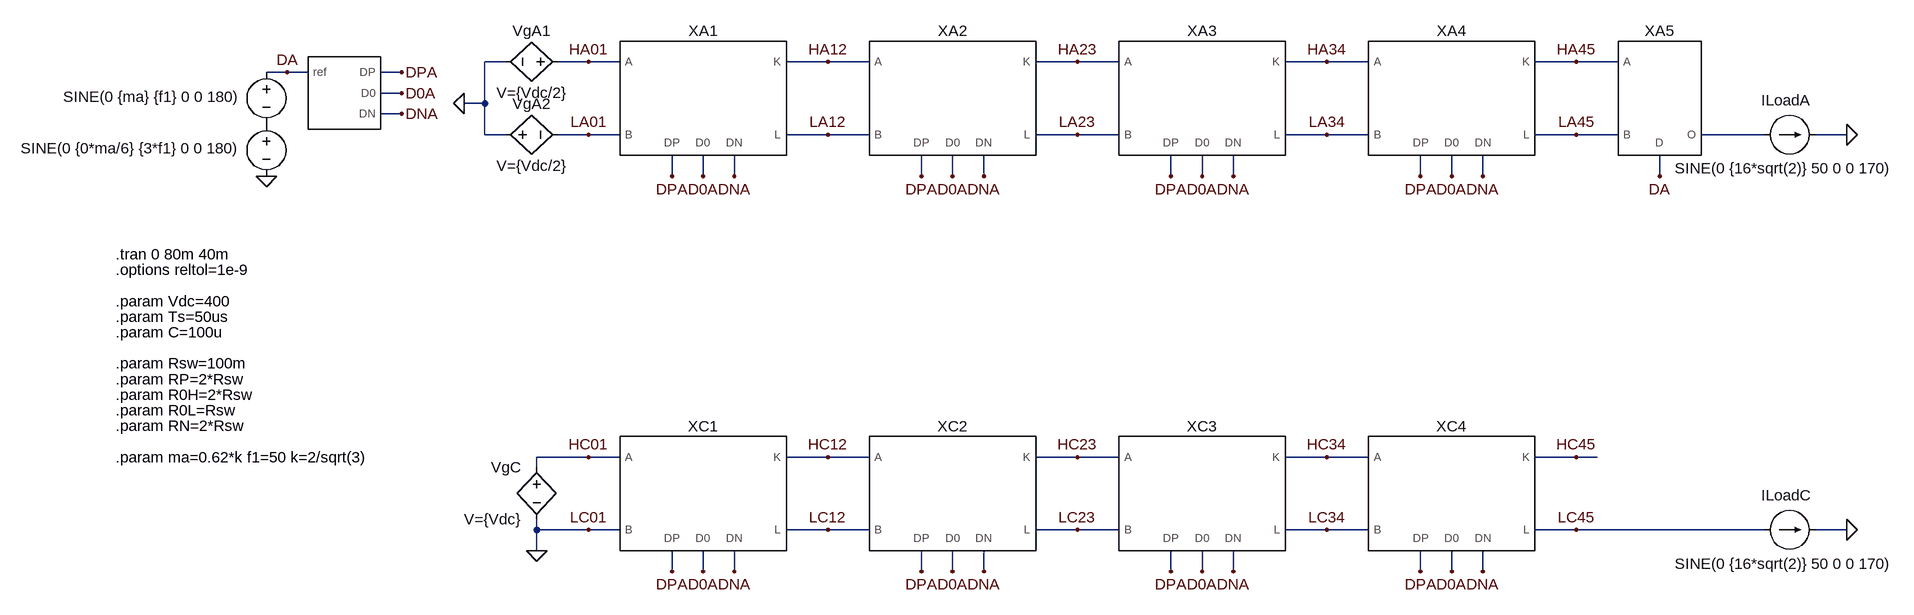
[diagram p0: schematic converter_scaling_ideal_2.asc]
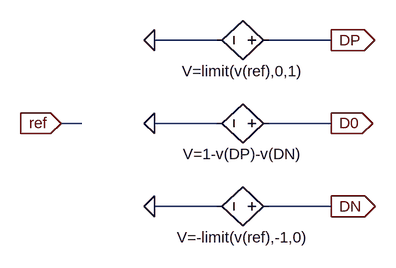
[diagram p1: sub-circuit pn_average_modulator.asc]
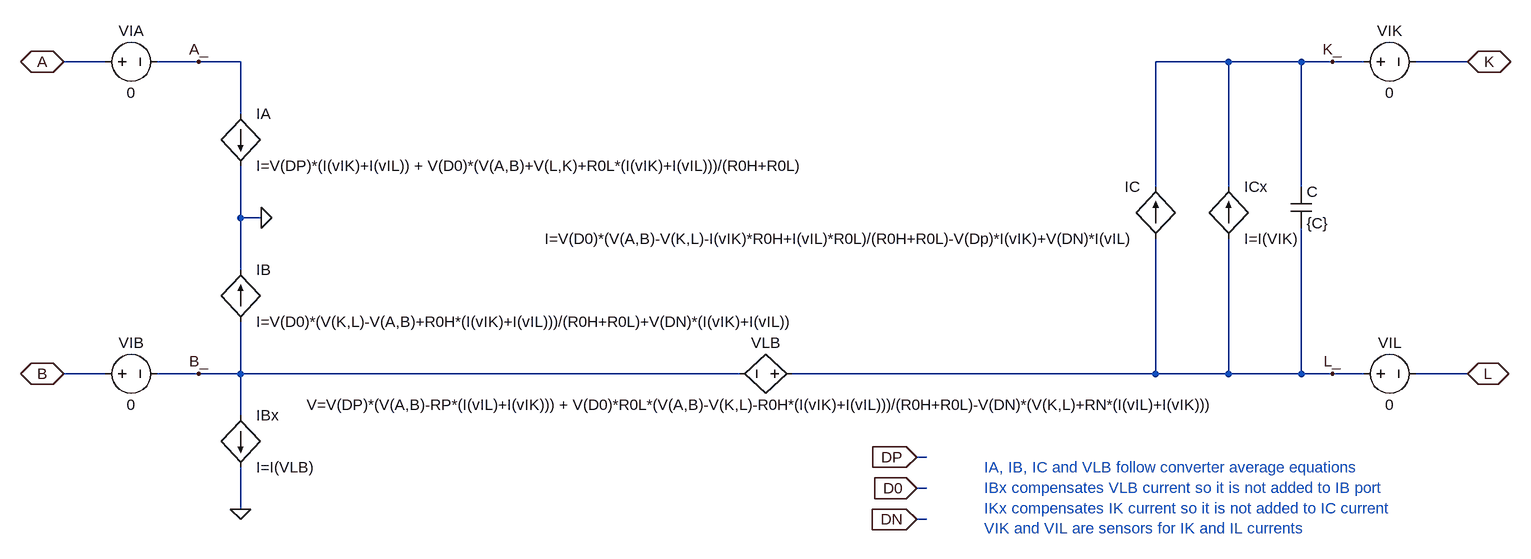
[diagram p2: sub-circuit pn_average_model.asc]
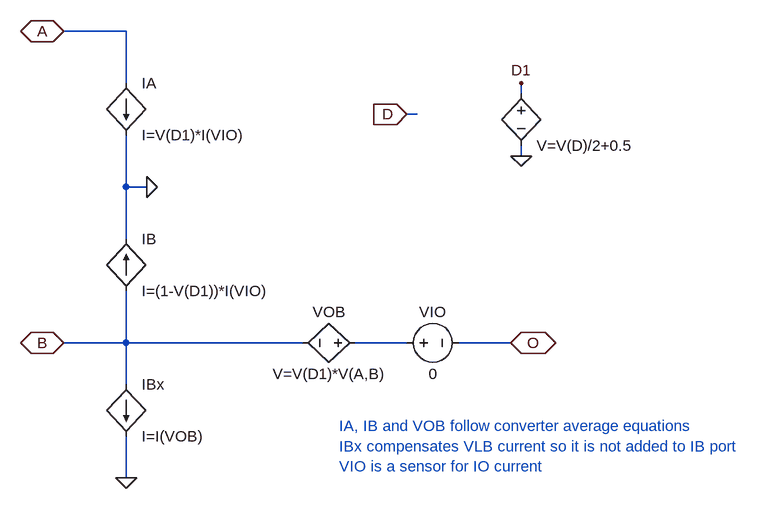
[diagram p3: sub-circuit 2l_average_model.asc]
converter_scaling_ideal_2.asc, the LTspice schematic file:
Version 4
SHEET 1 4616 1844
WIRE 2080 -1392 2048 -1392
WIRE 2208 -1392 2160 -1392
WIRE 2256 -1392 2208 -1392
WIRE 2576 -1392 2512 -1392
WIRE 2640 -1392 2576 -1392
WIRE 2960 -1392 2896 -1392
WIRE 3024 -1392 2960 -1392
WIRE 3344 -1392 3280 -1392
WIRE 3408 -1392 3344 -1392
WIRE 3728 -1392 3664 -1392
WIRE 3792 -1392 3728 -1392
WIRE 1744 -1376 1712 -1376
WIRE 1776 -1376 1744 -1376
WIRE 1920 -1376 1888 -1376
WIRE 1920 -1344 1888 -1344
WIRE 2048 -1328 2048 -1392
WIRE 2048 -1328 2016 -1328
WIRE 1920 -1312 1888 -1312
WIRE 2048 -1280 2048 -1328
WIRE 2080 -1280 2048 -1280
WIRE 2208 -1280 2160 -1280
WIRE 2256 -1280 2208 -1280
WIRE 2576 -1280 2512 -1280
WIRE 2640 -1280 2576 -1280
WIRE 2960 -1280 2896 -1280
WIRE 3024 -1280 2960 -1280
WIRE 3344 -1280 3280 -1280
WIRE 3408 -1280 3344 -1280
WIRE 3728 -1280 3664 -1280
WIRE 3792 -1280 3728 -1280
WIRE 4016 -1280 3920 -1280
WIRE 4144 -1280 4096 -1280
WIRE 2336 -1216 2336 -1248
WIRE 2384 -1216 2384 -1248
WIRE 2432 -1216 2432 -1248
WIRE 2720 -1216 2720 -1248
WIRE 2768 -1216 2768 -1248
WIRE 2816 -1216 2816 -1248
WIRE 3104 -1216 3104 -1248
WIRE 3152 -1216 3152 -1248
WIRE 3200 -1216 3200 -1248
WIRE 3488 -1216 3488 -1248
WIRE 3536 -1216 3536 -1248
WIRE 3584 -1216 3584 -1248
WIRE 3856 -1216 3856 -1248
WIRE 2208 -784 2128 -784
WIRE 2256 -784 2208 -784
WIRE 2576 -784 2512 -784
WIRE 2640 -784 2576 -784
WIRE 2960 -784 2896 -784
WIRE 3024 -784 2960 -784
WIRE 3344 -784 3280 -784
WIRE 3408 -784 3344 -784
WIRE 3728 -784 3664 -784
WIRE 3760 -784 3728 -784
WIRE 2128 -768 2128 -784
WIRE 2128 -672 2128 -688
WIRE 2208 -672 2128 -672
WIRE 2256 -672 2208 -672
WIRE 2576 -672 2512 -672
WIRE 2640 -672 2576 -672
WIRE 2960 -672 2896 -672
WIRE 3024 -672 2960 -672
WIRE 3344 -672 3280 -672
WIRE 3408 -672 3344 -672
WIRE 3728 -672 3664 -672
WIRE 4016 -672 3728 -672
WIRE 4144 -672 4096 -672
WIRE 2128 -640 2128 -672
WIRE 2336 -608 2336 -640
WIRE 2384 -608 2384 -640
WIRE 2432 -608 2432 -640
WIRE 2720 -608 2720 -640
WIRE 2768 -608 2768 -640
WIRE 2816 -608 2816 -640
WIRE 3104 -608 3104 -640
WIRE 3152 -608 3152 -640
WIRE 3200 -608 3200 -640
WIRE 3488 -608 3488 -640
WIRE 3536 -608 3536 -640
WIRE 3584 -608 3584 -640
FLAG 1920 -1376 DPA
FLAG 1920 -1344 D0A
FLAG 1920 -1312 DNA
FLAG 1712 -1216 0
FLAG 1744 -1376 DA
FLAG 2336 -1216 DPA
FLAG 2384 -1216 D0A
FLAG 2432 -1216 DNA
FLAG 2016 -1328 0
FLAG 4144 -1280 0
FLAG 2720 -1216 DPA
FLAG 2768 -1216 D0A
FLAG 2816 -1216 DNA
FLAG 3104 -1216 DPA
FLAG 3152 -1216 D0A
FLAG 3200 -1216 DNA
FLAG 3488 -1216 DPA
FLAG 3536 -1216 D0A
FLAG 3584 -1216 DNA
FLAG 3856 -1216 DA
FLAG 2336 -608 DPA
FLAG 2384 -608 D0A
FLAG 2432 -608 DNA
FLAG 2128 -640 0
FLAG 4144 -672 0
FLAG 2720 -608 DPA
FLAG 2768 -608 D0A
FLAG 2816 -608 DNA
FLAG 3104 -608 DPA
FLAG 3152 -608 D0A
FLAG 3200 -608 DNA
FLAG 3488 -608 DPA
FLAG 3536 -608 D0A
FLAG 3584 -608 DNA
FLAG 2208 -1392 HA01
FLAG 2576 -1392 HA12
FLAG 2960 -1392 HA23
FLAG 3344 -1392 HA34
FLAG 3728 -1392 HA45
FLAG 2208 -1280 LA01
FLAG 2576 -1280 LA12
FLAG 2960 -1280 LA23
FLAG 3344 -1280 LA34
FLAG 3728 -1280 LA45
FLAG 2208 -784 HC01
FLAG 2576 -784 HC12
FLAG 2960 -784 HC23
FLAG 3344 -784 HC34
FLAG 3728 -784 HC45
FLAG 2208 -672 LC01
FLAG 2576 -672 LC12
FLAG 2960 -672 LC23
FLAG 3344 -672 LC34
FLAG 3728 -672 LC45
SYMBOL voltage 1712 -1392 M0
WINDOW 0 24 16 Invisible 2
WINDOW 3 39 54 Left 2
SYMATTR InstName V1
SYMATTR Value SINE(0 {ma} {f1} 0 0 180)
SYMBOL voltage 1712 -1312 M0
WINDOW 0 24 16 Invisible 2
WINDOW 3 39 53 Left 2
SYMATTR InstName V7
SYMATTR Value SINE(0 {0*ma/6} {3*f1} 0 0 180)
SYMBOL PN_average_modulator 1824 -1344 R0
WINDOW 0 8 -56 Invisible 2
SYMATTR InstName X2
SYMBOL bv 2176 -1392 M270
WINDOW 0 32 56 VTop 2
WINDOW 3 -32 56 VBottom 2
SYMATTR InstName VgA1
SYMATTR Value V={Vdc/2}
SYMBOL PN_average_model 2384 -1344 R0
SYMATTR InstName XA1
SYMATTR SpiceLine C={C*4} RP={RP/4} R0H={R0H/4} R0L={R0L/4} RN={RN/4}
SYMBOL current 4016 -1280 M90
WINDOW 123 0 0 Left 2
WINDOW 39 0 0 Left 2
WINDOW 3 52 -137 VRight 2
WINDOW 0 -53 -4 VRight 2
SYMATTR Value SINE(0 {16*sqrt(2)} 50 0 0 170)
SYMATTR InstName ILoadA
SYMBOL PN_average_model 2768 -1344 R0
SYMATTR InstName XA2
SYMATTR SpiceLine C={C*3} RP={RP/3} R0H={R0H/3} R0L={R0L/3} RN={RN/3}
SYMBOL PN_average_model 3152 -1344 R0
SYMATTR InstName XA3
SYMATTR SpiceLine C={C*2} RP={RP/2} R0H={R0H/2} R0L={R0L/2} RN={RN/2}
SYMBOL PN_average_model 3536 -1344 R0
SYMATTR InstName XA4
SYMATTR SpiceLine C={C} RP={RP} R0H={R0H} R0L={R0L} RN={RN}
SYMBOL 2L_average_model 3856 -1360 R0
SYMATTR InstName XA5
SYMBOL bv 2128 -784 M0
SYMATTR InstName VgC
SYMATTR Value V={Vdc}
SYMBOL PN_average_model 2384 -736 R0
SYMATTR InstName XC1
SYMATTR SpiceLine C={C*4} RP={RP/4} R0H={R0H/4} R0L={R0L/4} RN={RN/4}
SYMBOL current 4016 -672 M90
WINDOW 123 0 0 Left 2
WINDOW 39 0 0 Left 2
WINDOW 3 52 -137 VRight 2
WINDOW 0 -53 -4 VRight 2
SYMATTR Value SINE(0 {16*sqrt(2)} 50 0 0 170)
SYMATTR InstName ILoadC
SYMBOL PN_average_model 2768 -736 R0
SYMATTR InstName XC2
SYMATTR SpiceLine C={C*3} RP={RP/3} R0H={R0H/3} R0L={R0L/3} RN={RN/3}
SYMBOL PN_average_model 3152 -736 R0
SYMATTR InstName XC3
SYMATTR SpiceLine C={C*2} RP={RP/2} R0H={R0H/2} R0L={R0L/2} RN={RN/2}
SYMBOL PN_average_model 3536 -736 R0
SYMATTR InstName XC4
SYMATTR SpiceLine C={C} RP={RP} R0H={R0H} R0L={R0L} RN={RN}
SYMBOL bv 2064 -1280 M90
WINDOW 0 -32 56 VBottom 2
WINDOW 3 32 56 VTop 2
SYMATTR InstName VgA2
SYMATTR Value V={Vdc/2}
TEXT 1480 -1000 Left 2 !.param Ts=50us
TEXT 1480 -1096 Left 2 !.tran 0 80m 40m
TEXT 1480 -1024 Left 2 !.param Vdc=400
TEXT 1480 -784 Left 2 !.param ma=0.62*k f1=50 k=2/sqrt(3)
TEXT 1480 -928 Left 2 !.param Rsw=100m
TEXT 1480 -904 Left 2 !.param RP=2*Rsw
TEXT 1480 -832 Left 2 !.param RN=2*Rsw
TEXT 1480 -880 Left 2 !.param R0H=2*Rsw
TEXT 1480 -856 Left 2 !.param R0L=Rsw
TEXT 1480 -976 Left 2 !.param C=100u
TEXT 1480 -1072 Left 2 !.options reltol=1e-9

pn_average_modulator.asc, the sub-circuit schematic file:
Version 4
SHEET 1 880 680
WIRE 304 160 208 160
WIRE 480 160 384 160
WIRE 96 288 64 288
WIRE 304 288 208 288
WIRE 480 288 384 288
WIRE 304 416 208 416
WIRE 480 416 384 416
FLAG 208 160 0
FLAG 208 288 0
FLAG 208 416 0
FLAG 480 160 DP
IOPIN 480 160 Out
FLAG 480 288 D0
IOPIN 480 288 Out
FLAG 480 416 DN
IOPIN 480 416 Out
FLAG 64 288 ref
IOPIN 64 288 In
SYMBOL bv 400 160 R90
WINDOW 0 -32 56 Invisible 2
WINDOW 3 32 56 VTop 2
SYMATTR InstName Bpos1
SYMATTR Value V=limit(v(ref),0,1)
SYMBOL bv 400 288 R90
WINDOW 0 -32 56 Invisible 2
WINDOW 3 32 56 VTop 2
SYMATTR InstName Bzero1
SYMATTR Value V=1-v(DP)-v(DN)
SYMBOL bv 400 416 R90
WINDOW 0 -32 56 Invisible 2
WINDOW 3 32 56 VTop 2
SYMATTR InstName Bneg1
SYMATTR Value V=-limit(v(ref),-1,0)

pn_average_model.asc, the sub-circuit schematic file:
Version 4
SHEET 1 2060 780
WIRE -720 16 -784 16
WIRE -576 16 -640 16
WIRE -512 16 -576 16
WIRE 1008 16 896 16
WIRE 1120 16 1008 16
WIRE 1168 16 1120 16
WIRE 1216 16 1168 16
WIRE 1376 16 1296 16
WIRE -512 96 -512 16
WIRE 896 208 896 16
WIRE 1008 208 1008 16
WIRE 1120 208 1120 16
WIRE -512 256 -512 176
WIRE -480 256 -512 256
WIRE -512 336 -512 256
WIRE -720 496 -784 496
WIRE -576 496 -640 496
WIRE -512 496 -512 416
WIRE -512 496 -576 496
WIRE 256 496 -512 496
WIRE 896 496 896 288
WIRE 896 496 336 496
WIRE 1008 496 1008 288
WIRE 1008 496 896 496
WIRE 1120 496 1120 272
WIRE 1120 496 1008 496
WIRE 1168 496 1120 496
WIRE 1216 496 1168 496
WIRE 1376 496 1296 496
WIRE -512 560 -512 496
WIRE 544 624 528 624
WIRE 544 672 528 672
WIRE -512 704 -512 640
WIRE 544 720 528 720
FLAG 1376 16 K
IOPIN 1376 16 BiDir
FLAG 1376 496 L
IOPIN 1376 496 BiDir
FLAG -784 16 A
IOPIN -784 16 BiDir
FLAG -784 496 B
IOPIN -784 496 BiDir
FLAG 528 624 DP
IOPIN 528 624 In
FLAG 528 672 D0
IOPIN 528 672 In
FLAG 528 720 DN
IOPIN 528 720 In
FLAG -480 256 0
FLAG -512 704 0
FLAG -576 16 A_
FLAG -576 496 B_
FLAG 1168 16 K_
FLAG 1168 496 L_
SYMBOL bv 352 496 R90
WINDOW 0 -32 56 VBottom 2
WINDOW 3 32 56 VTop 2
SYMATTR InstName VLB
SYMATTR Value V=V(DP)*(V(A,B)-RP*(I(vIL)+I(vIK))) + V(D0)*R0L*(V(A,B)-V(K,L)-R0H*(I(vIK)+I(vIL)))/(R0H+R0L)-V(DN)*(V(K,L)+RN*(I(vIL)+I(vIK)))
SYMBOL bi -512 96 R0
SYMATTR InstName IA
SYMATTR Value I=V(DP)*(I(vIK)+I(vIL)) + V(D0)*(V(A,B)+V(L,K)+R0L*(I(vIK)+I(vIL)))/(R0H+R0L)
SYMBOL cap 1104 208 R0
SYMATTR InstName C
SYMATTR Value {C}
SYMBOL bi 896 288 R180
WINDOW 0 24 80 Left 2
WINDOW 3 24 0 Left 2
SYMATTR InstName IC
SYMATTR Value I=V(D0)*(V(A,B)-V(K,L)-I(vIK)*R0H+I(vIL)*R0L)/(R0H+R0L)-V(Dp)*I(vIK)+V(DN)*I(vIL)
SYMBOL bi -512 416 M180
WINDOW 0 24 80 Left 2
WINDOW 3 24 0 Left 2
SYMATTR InstName IB
SYMATTR Value I=V(D0)*(V(K,L)-V(A,B)+R0H*(I(vIK)+I(vIL)))/(R0H+R0L)+V(DN)*(I(vIK)+I(vIL))
SYMBOL voltage 1200 496 R270
WINDOW 0 32 56 VTop 2
WINDOW 3 -32 56 VBottom 2
SYMATTR InstName VIL
SYMATTR Value 0
SYMBOL voltage 1200 16 R270
WINDOW 0 32 56 VTop 2
WINDOW 3 -32 56 VBottom 2
SYMATTR InstName VIK
SYMATTR Value 0
SYMBOL bi -512 560 R0
SYMATTR InstName IBx
SYMATTR Value I=I(VLB)
SYMBOL bi 1008 288 M180
WINDOW 0 24 80 Left 2
WINDOW 3 24 0 Left 2
SYMATTR InstName ICx
SYMATTR Value I=I(VIK)
SYMBOL voltage -736 496 R270
WINDOW 0 32 56 VTop 2
WINDOW 3 -32 56 VBottom 2
SYMATTR InstName VIB
SYMATTR Value 0
SYMBOL voltage -736 16 R270
WINDOW 0 32 56 VTop 2
WINDOW 3 -32 56 VBottom 2
SYMATTR InstName VIA
SYMATTR Value 0
TEXT 632 640 Left 2 ;IA, IB, IC and VLB follow converter average equations\nIBx compensates VLB current so it is not added to IB port\nIKx compensates IK current so it is not added to IC current\nVIK and VIL are sensors for IK and IL currents

2l_average_model.asc, the sub-circuit schematic file:
Version 4
SHEET 1 2060 780
WIRE -512 16 -608 16
WIRE -512 96 -512 16
WIRE 96 112 96 96
WIRE -64 144 -80 144
WIRE 96 208 96 192
WIRE -512 256 -512 176
WIRE -480 256 -512 256
WIRE -512 336 -512 256
WIRE -512 496 -512 416
WIRE -512 496 -608 496
WIRE -240 496 -512 496
WIRE -80 496 -160 496
WIRE 80 496 0 496
WIRE -512 560 -512 496
WIRE -512 704 -512 640
FLAG 80 496 O
IOPIN 80 496 BiDir
FLAG -608 16 A
IOPIN -608 16 BiDir
FLAG -608 496 B
IOPIN -608 496 BiDir
FLAG -80 144 D
IOPIN -80 144 In
FLAG -480 256 0
FLAG -512 704 0
FLAG 96 208 0
FLAG 96 96 D1
SYMBOL bv -144 496 R90
WINDOW 0 -32 56 VBottom 2
WINDOW 3 32 56 VTop 2
SYMATTR InstName VOB
SYMATTR Value V=V(D1)*V(A,B)
SYMBOL bi -512 96 R0
SYMATTR InstName IA
SYMATTR Value I=V(D1)*I(VIO)
SYMBOL bi -512 416 M180
WINDOW 0 24 80 Left 2
WINDOW 3 24 0 Left 2
SYMATTR InstName IB
SYMATTR Value I=(1-V(D1))*I(VIO)
SYMBOL voltage -96 496 R270
WINDOW 0 32 56 VTop 2
WINDOW 3 -32 56 VBottom 2
SYMATTR InstName VIO
SYMATTR Value 0
SYMBOL bi -512 560 R0
SYMATTR InstName IBx
SYMATTR Value I=I(VOB)
SYMBOL bv 96 96 R0
WINDOW 0 24 16 Invisible 2
SYMATTR InstName VD
SYMATTR Value V=V(D)/2+0.5
TEXT -184 624 Left 2 ;IA, IB and VOB follow converter average equations\nIBx compensates VLB current so it is not added to IB port\nVIO is a sensor for IO current

The netlist it stands for:
* converter_scaling_ideal_2.asc
V1 DA P001 SINE(0 {ma} {f1} 0 0 180)
V7 P001 0 SINE(0 {0*ma/6} {3*f1} 0 0 180)
XX2 DA D0A DNA DPA pn_average_modulator
B§VgA1 HA01 0 V={Vdc/2}
XXA1 D0A DNA DPA HA01 LA01 HA12 LA12 pn_average_model params: C={C*4} RP={RP/4} R0H={R0H/4} R0L={R0L/4} RN={RN/4}
ILoadA N001 0 SINE(0 {16*sqrt(2)} 50 0 0 170)
XXA2 D0A DNA DPA HA12 LA12 HA23 LA23 pn_average_model params: C={C*3} RP={RP/3} R0H={R0H/3} R0L={R0L/3} RN={RN/3}
XXA3 D0A DNA DPA HA23 LA23 HA34 LA34 pn_average_model params: C={C*2} RP={RP/2} R0H={R0H/2} R0L={R0L/2} RN={RN/2}
XXA4 D0A DNA DPA HA34 LA34 HA45 LA45 pn_average_model params: C={C} RP={RP} R0H={R0H} R0L={R0L} RN={RN}
XXA5 DA HA45 LA45 N001 2l_average_model
B§VgC HC01 0 V={Vdc}
XXC1 D0A DNA DPA HC01 0 HC12 LC12 pn_average_model params: C={C*4} RP={RP/4} R0H={R0H/4} R0L={R0L/4} RN={RN/4}
ILoadC LC45 0 SINE(0 {16*sqrt(2)} 50 0 0 170)
XXC2 D0A DNA DPA HC12 LC12 HC23 LC23 pn_average_model params: C={C*3} RP={RP/3} R0H={R0H/3} R0L={R0L/3} RN={RN/3}
XXC3 D0A DNA DPA HC23 LC23 HC34 LC34 pn_average_model params: C={C*2} RP={RP/2} R0H={R0H/2} R0L={R0L/2} RN={RN/2}
XXC4 D0A DNA DPA HC34 LC34 HC45 LC45 pn_average_model params: C={C} RP={RP} R0H={R0H} R0L={R0L} RN={RN}
B§VgA2 0 LA01 V={Vdc/2}

* block symbol definitions
.subckt pn_average_modulator ref D0 DN DP
Bpos1 DP 0 V=limit(v(ref),0,1)
Bzero1 D0 0 V=1-v(DP)-v(DN)
Bneg1 DN 0 V=-limit(v(ref),-1,0)
.ends pn_average_modulator

.subckt pn_average_model D0 DN DP A B K L
B§VLB L_ B_ V=V(DP)*(V(A,B)-RP*(I(vIL)+I(vIK))) + V(D0)*R0L*(V(A,B)-V(K,L)-R0H*(I(vIK)+I(vIL)))/(R0H+R0L)-V(DN)*(V(K,L)+RN*(I(vIL)+I(vIK)))
B§IA A_ 0 I=V(DP)*(I(vIK)+I(vIL)) + V(D0)*(V(A,B)+V(L,K)+R0L*(I(vIK)+I(vIL)))/(R0H+R0L)
C K_ L_ {C}
B§IC L_ K_ I=V(D0)*(V(A,B)-V(K,L)-I(vIK)*R0H+I(vIL)*R0L)/(R0H+R0L)-V(Dp)*I(vIK)+V(DN)*I(vIL)
B§IB B_ 0 I=V(D0)*(V(K,L)-V(A,B)+R0H*(I(vIK)+I(vIL)))/(R0H+R0L)+V(DN)*(I(vIK)+I(vIL))
VIL L_ L 0
VIK K_ K 0
B§IBx B_ 0 I=I(VLB)
B§ICx L_ K_ I=I(VIK)
VIB B B_ 0
VIA A A_ 0
* IA, IB, IC and VLB follow converter average equations
* IBx compensates VLB current so it is not added to IB port
* IKx compensates IK current so it is not added to IC current
* VIK and VIL are sensors for IK and IL currents
.ends pn_average_model

.subckt 2l_average_model D A B O
B§VOB N001 B V=V(D1)*V(A,B)
B§IA A 0 I=V(D1)*I(VIO)
B§IB B 0 I=(1-V(D1))*I(VIO)
VIO N001 O 0
B§IBx B 0 I=I(VOB)
B§VD D1 0 V=V(D)/2+0.5
* IA, IB and VOB follow converter average equations
* IBx compensates VLB current so it is not added to IB port
* VIO is a sensor for IO current
.ends 2l_average_model

.param Ts=50us
.tran 0 80m 40m
.param Vdc=400
.param ma=0.62*k f1=50 k=2/sqrt(3)
.param Rsw=100m
.param RP=2*Rsw
.param RN=2*Rsw
.param R0H=2*Rsw
.param R0L=Rsw
.param C=100u
.options reltol=1e-9
.backanno
.end